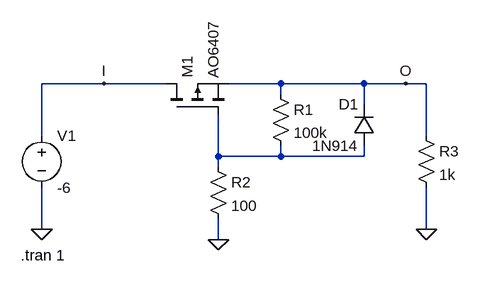
[diagram p0: schematic Reverse_V_with_PMOS.asc]
Reverse_V_with_PMOS.asc, the LTspice schematic file:
Version 4
SHEET 1 880 680
WIRE 80 96 -16 96
WIRE 176 96 80 96
WIRE 352 96 272 96
WIRE 480 96 352 96
WIRE 544 96 480 96
WIRE 576 96 544 96
WIRE 352 112 352 96
WIRE 480 128 480 96
WIRE -16 176 -16 96
WIRE 576 176 576 96
WIRE 256 208 256 144
WIRE 352 208 352 192
WIRE 352 208 256 208
WIRE 480 208 480 192
WIRE 480 208 352 208
WIRE 256 224 256 208
WIRE -16 320 -16 256
WIRE 576 320 576 256
WIRE 256 336 256 304
FLAG 256 336 0
FLAG -16 320 0
FLAG 576 320 0
FLAG 80 96 I
FLAG 544 96 O
SYMBOL pmos 176 144 R270
SYMATTR InstName M1
SYMATTR Value AO6407
SYMBOL res 336 96 R0
SYMATTR InstName R1
SYMATTR Value 100k
SYMBOL res 240 208 R0
SYMATTR InstName R2
SYMATTR Value 100
SYMBOL diode 496 192 R180
WINDOW 0 24 64 Left 2
WINDOW 3 24 0 Left 2
SYMATTR InstName D1
SYMATTR Value 1N914
SYMBOL voltage -16 160 R0
WINDOW 123 0 0 Left 0
WINDOW 39 0 0 Left 0
SYMATTR InstName V1
SYMATTR Value -6
SYMBOL res 560 160 R0
SYMATTR InstName R3
SYMATTR Value 1k
TEXT -48 360 Left 2 !.tran 1

The netlist it stands for:
* Reverse_V_with_PMOS.asc
M1 I N001 O O AO6407
R1 O N001 100k
R2 N001 0 100
D1 N001 O 1N914
V1 I 0 -6
R3 O 0 1k
.model D D
.lib standard.dio
.model NMOS NMOS
.model PMOS PMOS
.lib standard.mos
.tran 1
.backanno
.end